# Altium schematic sheet Sheet4.SchDoc
size A4
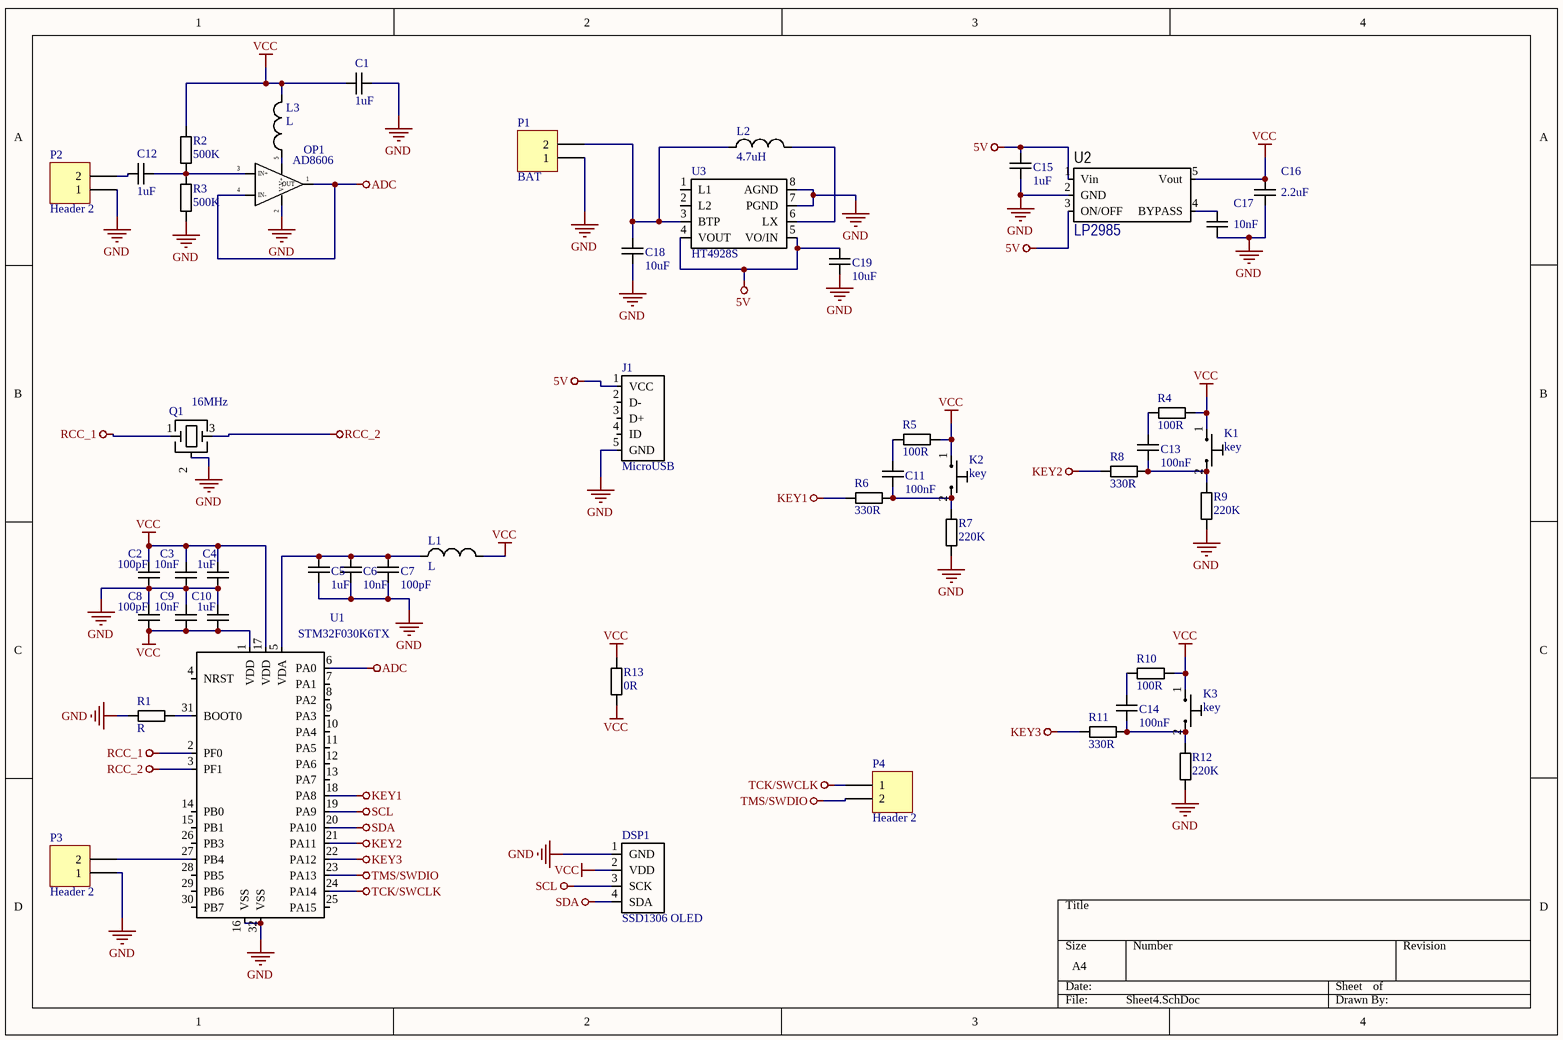
[diagram p0: Sheet4.SchDoc]

## Parts
C1  1uF  [SMD-0402C]
C2  100pF  [SMD-0402C]
C3  10nF  [SMD-0402C]
C4  1uF  [SMD-0402C]
C5  1uF  [SMD-0402C]
C6  10nF  [SMD-0402C]
C7  100pF  [SMD-0402C]
C8  100pF  [SMD-0402C]
C9  10nF  [SMD-0402C]
C10  1uF  [SMD-0402C]
C11  100nF  [SMD-0402C]
C12  1uF  [SMD-0402C]
C13  100nF  [SMD-0402C]
C14  100nF  [SMD-0402C]
C15  1uF  [SMD-0402C]
C16  2.2uF  [SMD-0402C]
C17  10nF  [SMD-0402C]
C18  10uF  [SMD-0805C]
C19  10uF  [SMD-0805C]
DSP1  SSD1306 OLED  [SSD1306]
J1  MicroUSB  [Micro USB]
K1  key  [KEY]
K2  key  [KEY]
K3  key  [KEY]
L1  L  [L_0805]
L2  4.7uH  [CD43]
L3  L  [L_0805]
OP1  AD8606  [SOT-23-5]
P1  BAT  [MHDR1X2]
P2  Header 2  [HDR1X2]
P3  Header 2  [HDR1X2]
P4  Header 2  [HDR1X2]
Q1  16MHz  [Murata Ceramic Resonator]
R1  R  [SMD-0402-RES]
R2  500K  [SMD-0402-RES]
R3  500K  [SMD-0402-RES]
R4  100R  [SMD-0402-RES]
R5  100R  [SMD-0402-RES]
R6  330R  [SMD-0402-RES]
R7  220K  [SMD-0402-RES]
R8  330R  [SMD-0402-RES]
R9  220K  [SMD-0402-RES]
R10  100R  [SMD-0402-RES]
R11  330R  [SMD-0402-RES]
R12  220K  [SMD-0402-RES]
R13  0R  [SMD-0805-RES]
U1  STM32F030K6TX  [LQFP-32]
U2  LP2985  [SOT-23-5]
U3  HT4928S  [SOIC8]

## Nets
5V: C15.2 C19.1 J1.1(VCC) U2.1(Vin) U2.3(ON/OFF) U3.4(VOUT) U3.5(VO/IN)
ADC: OP1.1(OUT) OP1.4(IN-) U1.6(PA0)
GND: C1.1 C2.1 C3.2 C4.1 C5.2 C6.1 C7.2 C8.2 C9.1 C10.2 C15.1 C16.1 C17.1 C18.2 C19.2 DSP1.1(GND) J1.5(GND) OP1.2(V-) P1.1 P2.1 P3.1 Q1.2 R1.1 R3.1 R7.1 R9.1 R12.1 U1.16(VSS) U1.32(VSS) U2.2(GND) U3.7(PGND) U3.8(AGND)
KEY1: R6.1 U1.18(PA8)
KEY2: R8.1 U1.21(PA11)
KEY3: R11.1 U1.22(PA12)
RCC_1: Q1.1 U1.2(PF0)
RCC_2: Q1.3 U1.3(PF1)
SCL: DSP1.3(SCK) U1.19(PA9)
SDA: DSP1.4(SDA) U1.20(PA10)
TCK/SWCLK: P4.1 U1.24(PA14)
TMS/SWDIO: P4.2 U1.23(PA13)
VCC: C1.2 C2.2 C3.1 C4.2 C8.1 C9.2 C10.1 C16.2 DSP1.2(VDD) K1.1 K2.1 K3.1 L1.2 L3.2 R2.2 R4.2 R5.2 R10.2 R13.1 R13.2 U1.1(VDD) U1.17(VDD) U2.5(Vout)
NetC5_1: C5.1 C6.2 C7.1 L1.1 U1.5(VDA)
NetC11_1: C11.1 K2.2 R6.2 R7.2
NetC11_2: C11.2 R5.1
NetC12_1: C12.1 OP1.3(IN+) R2.1 R3.2
NetC12_2: C12.2 P2.2
NetC13_1: C13.1 K1.2 R8.2 R9.2
NetC13_2: C13.2 R4.1
NetC14_1: C14.1 K3.2 R11.2 R12.2
NetC14_2: C14.2 R10.1
NetC17_2: C17.2 U2.4(BYPASS)
NetC18_1: C18.1 L2.1 P1.2 U3.3(BTP)
NetL2_2: L2.2 U3.6(LX)
NetL3_1: L3.1 OP1.5(V+)
NetP3_2: P3.2 U1.27(PB4)
NetR1_2: R1.2 U1.31(BOOT0)

Not connected (* = marked no-connect by the designer): J1 2(D-) 3(D+) 4(ID); U1 4(NRST) 7(PA1) 8(PA2) 9(PA3) 10(PA4) 11(PA5) 12(PA6) 13(PA7) 14(PB0) 15(PB1) 25(PA15) 26(PB3) 28(PB5) 29(PB6) 30(PB7); U3 1(L1) 2(L2)

## Library data of the parts
C1-C19 = С
DSP1 = SSD1306_OLED
J1 = Micro_USB_female
L2 = L
OP1 = AD8605
P1 = MHDR1X2: Header, 2-Pin; LatestRevisionDate: 17-Jul-2002; LatestRevisionNote: Re-released for DXP Platform.; Publisher: Altium Limited
P2-P4 = Header 2: Header, 2-Pin; LatestRevisionDate: 17-Jul-2002; LatestRevisionNote: Re-released for DXP Platform.; Publisher: Altium Limited
Q1 = Crystal_3
R2-R13 = R